# EAGLE design ReturnLossFixture (EAGLE 9.3.1)
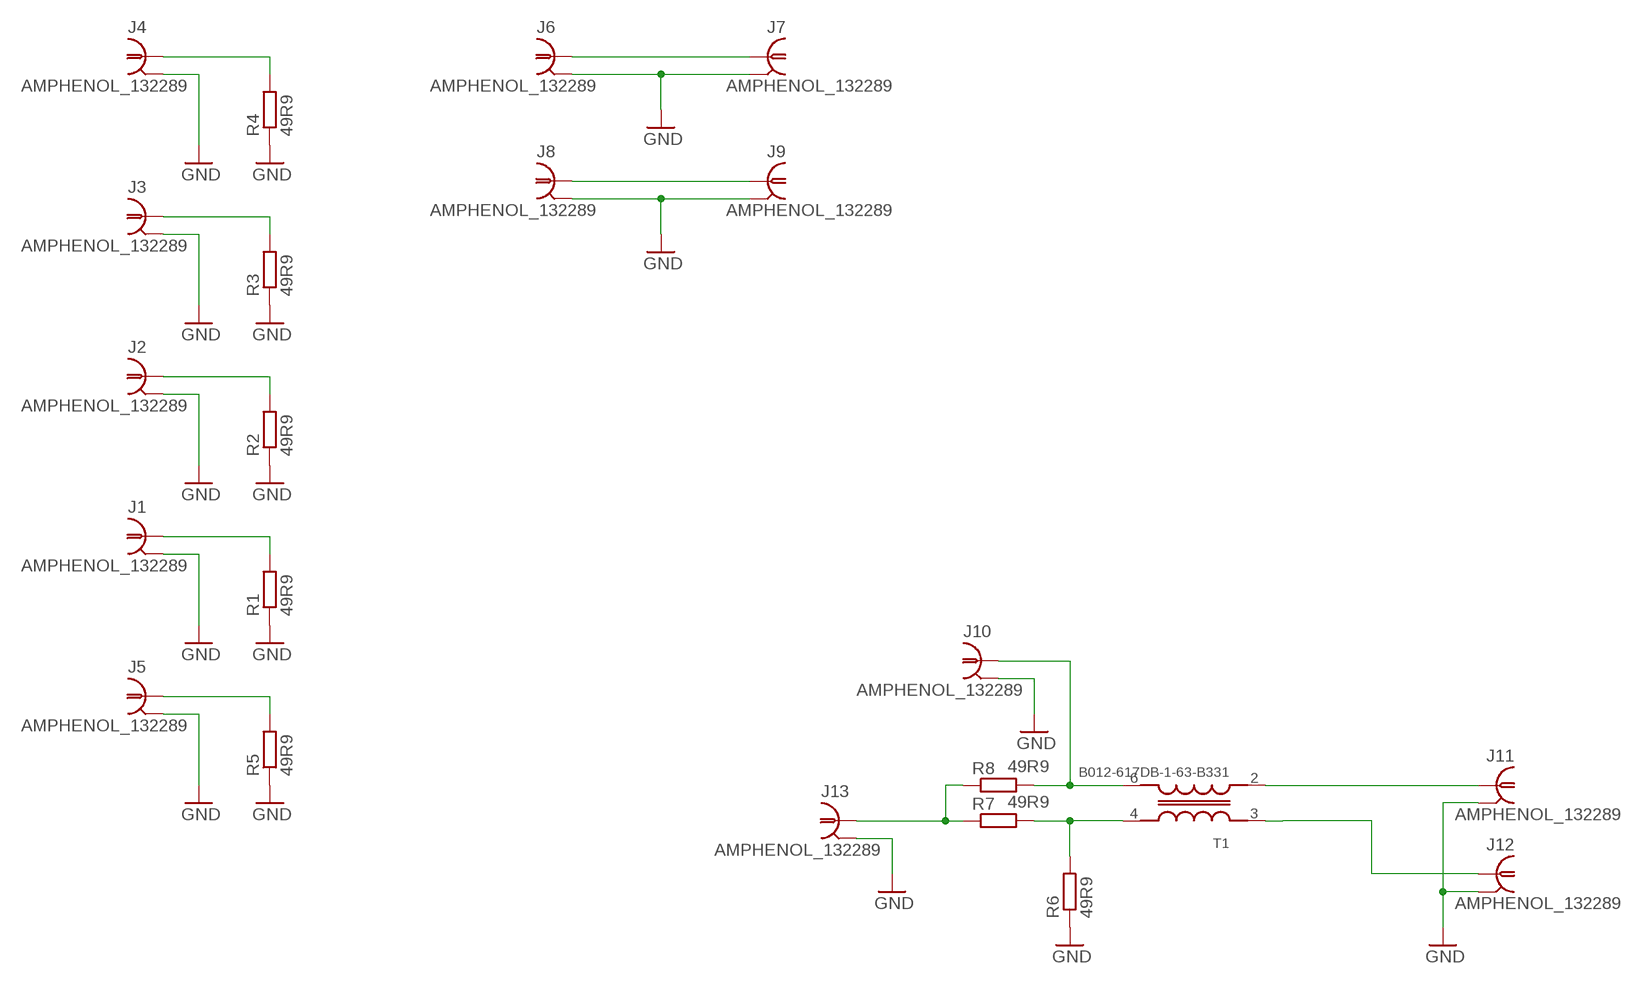
[diagram p0: schematic, sheet 1]

## Parts
J1  AMPHENOL_132289  [AMPHENOL_132289]
J2  AMPHENOL_132289  [AMPHENOL_132289]
J3  AMPHENOL_132289  [AMPHENOL_132289]
J4  AMPHENOL_132289  [AMPHENOL_132289]
J5  AMPHENOL_132289  [AMPHENOL_132289]
J6  AMPHENOL_132289  [AMPHENOL_132289]
J7  AMPHENOL_132289  [AMPHENOL_132289]
J8  AMPHENOL_132289  [AMPHENOL_132289]
J9  AMPHENOL_132289  [AMPHENOL_132289]
J10  AMPHENOL_132289  [AMPHENOL_132289]
J11  AMPHENOL_132289  [AMPHENOL_132289]
J12  AMPHENOL_132289  [AMPHENOL_132289]
J13  AMPHENOL_132289  [AMPHENOL_132289]
R1  49R9  R-EU_R0402  [R0402]
R2  49R9  R-EU_R0402  [R0402]
R3  49R9  R-EU_R0402  [R0402]
R4  49R9  R-EU_R0402  [R0402]
R5  49R9  R-EU_R0402  [R0402]
R6  49R9  R-EU_R0402  [R0402]
R7  49R9  R-EU_R0402  [R0402]
R8  49R9  R-EU_R0402  [R0402]
T1  B012-617DB-1-63-B331  [EASTEVER_BALUN]

## Nets
GND: J1.G@1 J1.G@2 J1.G@3 J1.G@4 J2.G@1 J2.G@2 J2.G@3 J2.G@4 J3.G@1 J3.G@2 J3.G@3 J3.G@4 J4.G@1 J4.G@2 J4.G@3 J4.G@4 J5.G@1 J5.G@2 J5.G@3 J5.G@4 J6.G@1 J6.G@2 J6.G@3 J6.G@4 J7.G@1 J7.G@2 J7.G@3 J7.G@4 J8.G@1 J8.G@2 J8.G@3 J8.G@4 J9.G@1 J9.G@2 J9.G@3 J9.G@4 J10.G@1 J10.G@2 J10.G@3 J10.G@4 J11.G@1 J11.G@2 J11.G@3 J11.G@4 J12.G@1 J12.G@2 J12.G@3 J12.G@4 J13.G@1 J13.G@2 J13.G@3 J13.G@4 R1.1 R2.1 R3.1 R4.1 R5.1 R6.1
N$1: J1.1 R1.2
N$2: J2.1 R2.2
N$3: J3.1 R3.2
N$4: J4.1 R4.2
N$5: J5.1 R5.2
N$6: J6.1 J7.1
N$7: J10.1 R8.2 T1.6(OUT-)
N$8: J8.1 J9.1
N$9: J12.1 T1.3(IN+)
N$10: J11.1 T1.2(IN-)
N$11: R6.2 R7.2 T1.4(OUT+)
N$12: J13.1 R7.1 R8.1

## Library data of the parts
J1-J13 = VNA:AMPHENOL_132289
R1-R8 = VNA:R-EU_: RESISTOR, European symbol
T1 = VNA:B012-617DB-1-63-B331

## Board
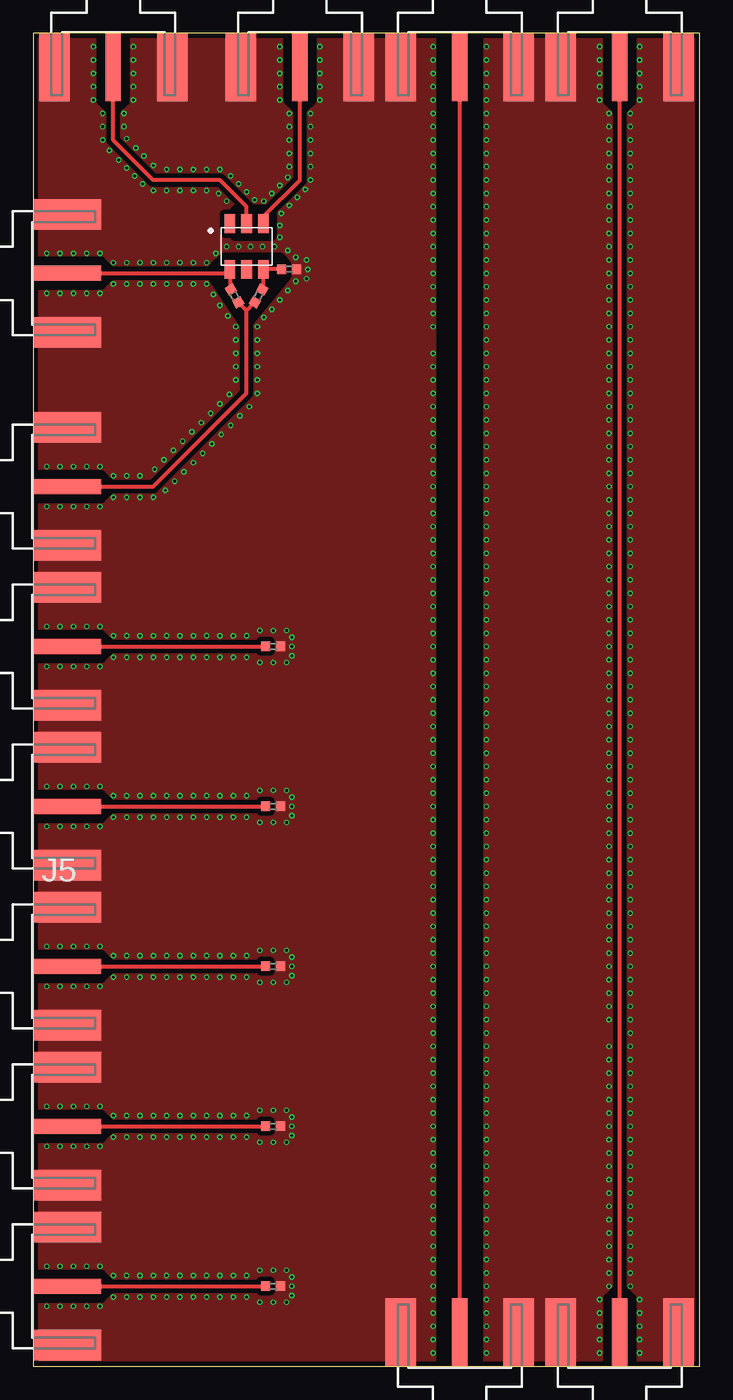
[diagram p1: board, top side]
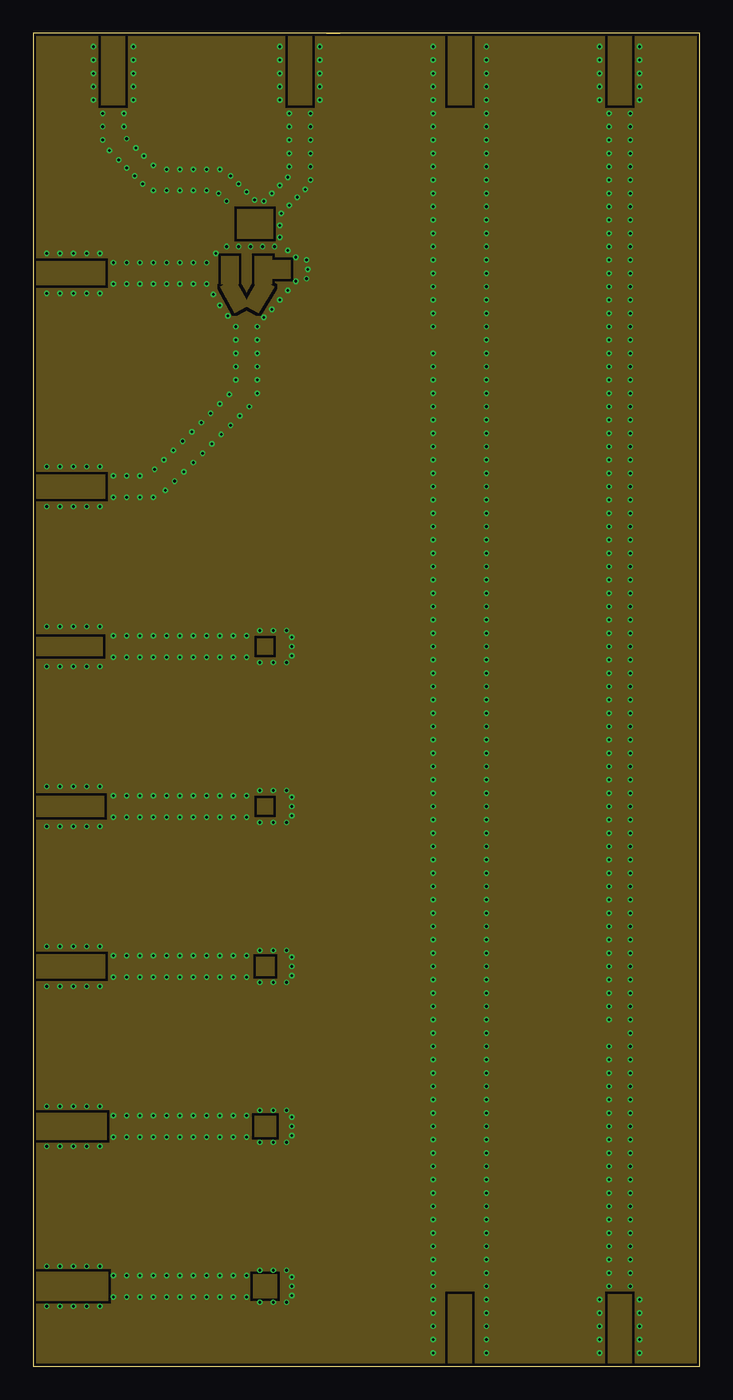
[diagram p2: board, inner layer Route2]
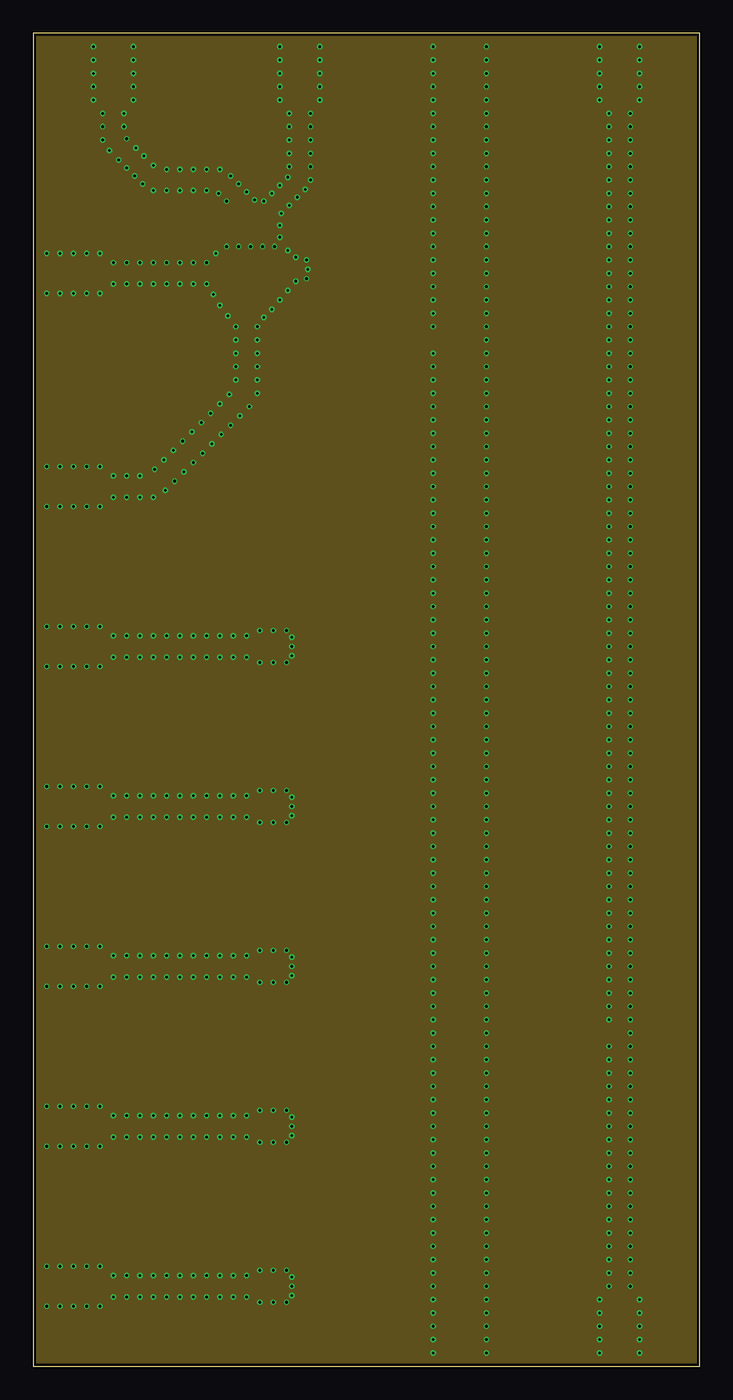
[diagram p3: board, inner layer Route15]
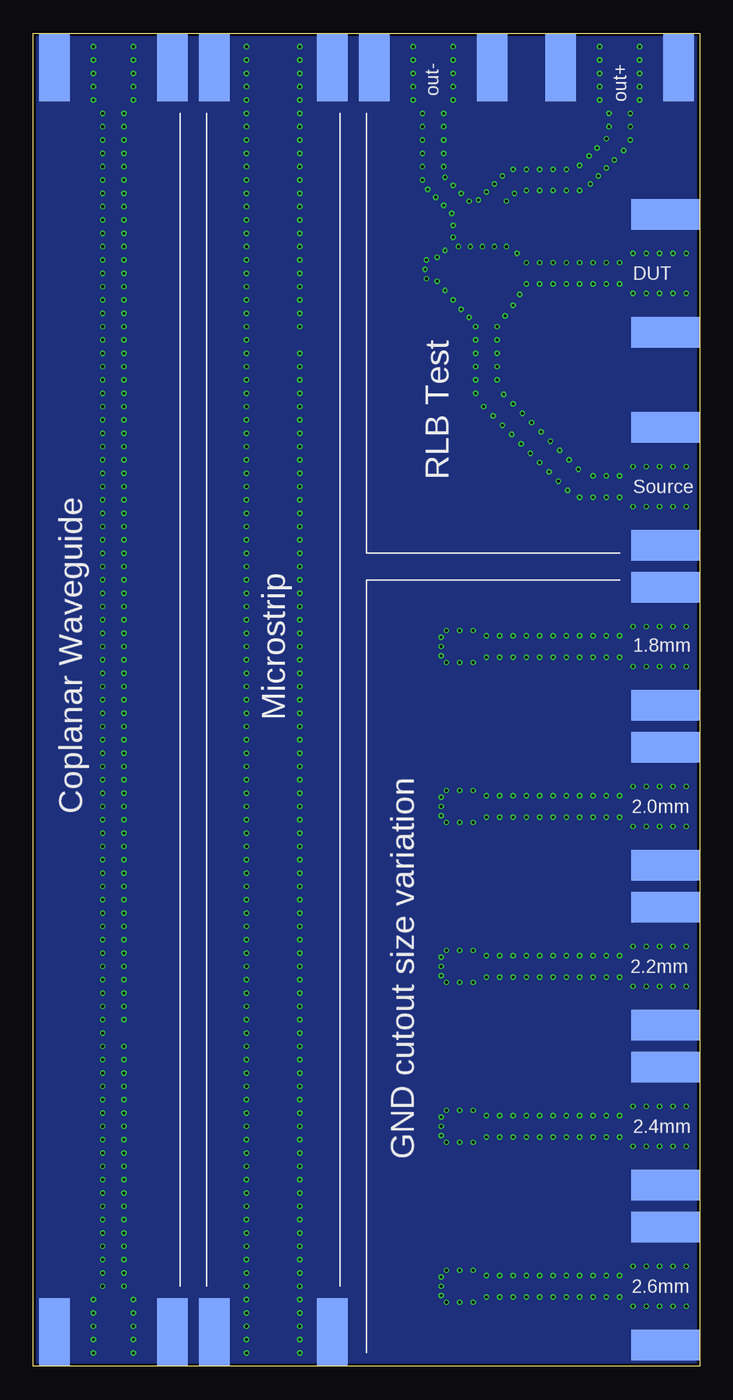
[diagram p4: board, bottom side, seen from below]

Size 50 x 100 mm. Coordinates in mm from the lower left corner, seen from the top.
Outline: 0,100 0,0 50,0 50,100 0,100
Copper layers (1+2*15+16): Top 0.035mm / dielectric 0.2mm / Route2 0.0175mm / dielectric 1.064mm / Route15 0.0175mm / dielectric 0.2mm / Bottom 0.035mm
Design rules "JLCPCB4L_7628 *": minimum track width 6mil, minimum drill 0.2mm, track to track 3.5mil, track to pad 3.5mil, pad to pad 3.5mil, via to via 3.5mil, smd to smd 0mil, copper to edge 0.2mm, drill to drill 0.2mm, minimum pad ring 10mil, minimum via ring 3.5mil, stop-mask expansion 4mil, vias tented up to drill 0mil, thermal gap 10mil
tRestrict: 57 lines

### Footprints (pad centres in the part's own frame; a part is rotated, then mirrored left to right if it is on the bottom)
AMPHENOL_132289 = smd 5.08 x 1.143: 1 2.565,0 | smd 5.08 x 2.286: G@1 2.565,4.42; G@2 2.565,-4.42 | smd 5.08 x 2.286 bottom: G@3 2.565,4.42; G@4 2.565,-4.42
R0402 = smd 0.67 x 0.72: 1 -0.56,0; 2 0.56,0
EASTEVER_BALUN = smd 1.4 x 0.8: 1 -1.715,-1.25; 2 -1.715,0; 3 -1.715,1.25; 4 1.715,1.25; 5 1.715,0; 6 1.715,-1.25

### Placement (x,y rotation side)
J1  0,6 0 top
J2  0,54 0 top
J3  0,18 0 top
J4  0,42 0 top
J5  0,30 0 top
J6  32,0 90 top
J7  32,100 270 top
J8  44,100 270 top
J9  44,0 90 top
J10  0,82 0 top
J11  6,100 270 top
J12  20,100 270 top
J13  0,66 0 top
R1  18,6 180 top
R2  18,54 180 top
R3  18,18 180 top
R4  18,42 180 top
R5  18,30 180 top
R6  19.2,82.3 180 top
R7  16.9,80.3 60 top
R8  15.1,80.3 120 top
T1  16,84 270 top

### Tracks (layer width: path | path; a pad name or v marks a point on that pad's centre or on a via)
CUTOUT
  Route2 0: 22,100 23,100
  pour Route2 (no thermals): 43.1,100 43.1,94.6 44.9,94.6 44.9,100
  pour Route2 (no thermals): 43.1,5.4 43.1,0 44.9,0 44.9,5.4
  pour Route2 (no thermals): 31.1,5.4 31.1,0 32.9,0 32.9,5.4
  pour Route2 (no thermals): 31.1,100 31.1,94.6 32.9,94.6 32.9,100
  pour Route2 (no thermals): 0,4.9 5.6,4.9 5.6,7.1 0,7.1
  pour Route2 (no thermals): 0,17 5.5,17 5.5,19 0,19
  pour Route2 (no thermals): 0,29.1 5.4,29.1 5.4,30.9 0,30.9
  pour Route2 (no thermals): 0,41.2 5.3,41.2 5.3,42.8 0,42.8
  pour Route2 (no thermals): 0,53.3 5.2,53.3 5.2,54.7 0,54.7
  pour Route2 (no thermals): 18.1,30.7 18.1,29.3 16.7,29.3 16.7,30.7
  pour Route2 (no thermals): 18,42.6 18,41.4 16.8,41.4 16.8,42.6
  pour Route2 (no thermals): 18,54.6 18,53.4 16.8,53.4 16.8,54.6
  pour Route2 (no thermals): 18.2,18.8 18.2,17.2 16.6,17.2 16.6,18.8
  pour Route2 (no thermals): 18.3,6.9 18.3,5.1 16.5,5.1 16.5,6.9
  pour Route2 (no thermals): 19.1,100 19.1,94.6 20.9,94.6 20.9,100
  pour Route2 (no thermals): 5.1,100 5.1,94.6 6.9,94.6 6.9,100
  pour Route2 (no thermals): 0,81.1 5.4,81.1 5.4,82.9 0,82.9
  pour Route2 (no thermals): 0,65.1 5.4,65.1 5.4,66.9 0,66.9
  pour Route2 (no thermals): 19.3,83 19.3,81.6 17.9,81.6 17.9,83
  pour Route2 (no thermals): 15.3,84.6 18,84.6 18,86.8 15.3,86.8
  pour Route2 (no thermals): 16.7,83.3 17.9,83.3 17.9,81.2 16.6,81.2 16.6,83.3
  pour Route2 (no thermals): 16.9,81.6 16,80 15.1,81.6 14,81 15.1,79 16,79.5 16.9,79 18.1,81
  pour Route2 (no thermals): 14.2,83.3 15.4,83.3 15.4,81.2 14.1,81.2 14.1,83.3
GND  (via drill 0.2 pad 0.4)
  other vias: 44.8,89 44.8,88 44.8,87 44.8,86 44.8,85 44.8,94 44.8,93 44.8,92 44.8,91 44.8,90 44.8,79 44.8,78 44.8,77 44.8,76 44.8,75 44.8,84 44.8,83 44.8,82 44.8,81 44.8,80 44.8,69 44.8,68 44.8,67 44.8,66 44.8,65 44.8,74 44.8,73 44.8,72 44.8,71 44.8,70 44.8,59 44.8,58 44.8,57 44.8,56 44.8,55 44.8,64 44.8,63 44.8,62 44.8,61 44.8,60 44.8,9 44.8,8 44.8,7 44.8,6 44.8,14 44.8,13 44.8,12 44.8,11 44.8,10 44.8,49 44.8,48 44.8,47 44.8,46 44.8,45 44.8,54 44.8,53 44.8,52 44.8,51 44.8,50 44.8,39 44.8,38 44.8,37 44.8,36 44.8,35 44.8,44 44.8,43 44.8,42 44.8,41 44.8,40 44.8,29 44.8,28 44.8,27 44.8,26 44.8,25 44.8,34 44.8,33 44.8,32 44.8,31 44.8,30 44.8,19 44.8,18 44.8,17 44.8,16 44.8,15 44.8,24 44.8,23 44.8,22 44.8,21 44.8,20 43.2,89 43.2,88 43.2,87 43.2,86 43.2,85 43.2,94 43.2,93 43.2,92 43.2,91 43.2,90 43.2,79 43.2,78 43.2,77 43.2,76 43.2,75 43.2,84 43.2,83 43.2,82 43.2,81 43.2,80 43.2,69 43.2,68 43.2,67 43.2,66 43.2,65 43.2,74 43.2,73 43.2,72 43.2,71 43.2,70 43.2,59 43.2,58 43.2,57 43.2,56 43.2,55 43.2,64 43.2,63 43.2,62 43.2,61 43.2,60 43.2,9 43.2,8 43.2,7 43.2,6 43.2,14 43.2,13 43.2,12 43.2,11 43.2,10 43.2,49 43.2,48 43.2,47 43.2,46 43.2,45 43.2,54 43.2,53 43.2,52 43.2,51 43.2,50 43.2,39 43.2,38 43.2,37 43.2,36 43.2,35 43.2,44 43.2,43 43.2,42 43.2,41 43.2,40 43.2,29 43.2,28 43.2,27 43.2,26 43.2,34 43.2,33 43.2,32 43.2,31 43.2,30 43.2,19 43.2,18 43.2,17 43.2,16 43.2,15 43.2,24 43.2,23 43.2,22 43.2,21 43.2,20 42.5,95 42.5,96 42.5,97 42.5,98 42.5,99 45.5,99 45.5,98 45.5,97 45.5,96 45.5,95 42.5,5 42.5,4 42.5,3 42.5,2 42.5,1 45.5,1 45.5,2 45.5,3 45.5,4 45.5,5 30,89 30,88 30,87 30,86 30,85 30,94 30,93 30,92 30,91 30,90 30,79 30,78 30,76 30,75 30,84 30,83 30,82 30,81 30,80 30,69 30,68 30,67 30,66 30,65 30,74 30,73 30,72 30,71 30,70 30,59 30,58 30,57 30,56 30,55 30,64 30,63 30,62 30,61 30,60 30,9 30,8 30,7 30,6 30,14 30,13 30,12 30,11 30,10 30,49 30,48 30,47 30,46 30,45 30,54 30,53 30,52 30,51 30,50 30,39 30,38 30,37 30,36 30,35 30,44 30,43 30,42 30,41 30,40 30,29 30,28 30,27 30,26 30,25 30,34 30,33 30,32 30,31 30,30 30,19 30,18 30,17 30,16 30,15 30,24 30,23 30,22 30,21 30,20 30,95 30,96 30,97 30,98 30,99 34,99 34,98 34,97 34,96 34,95 34,89 34,88 34,87 34,86 34,85 34,94 34,93 34,92 34,91 34,90 34,79 34,78 34,77 34,76 34,75 34,84 34,83 34,82 34,81 34,80 34,69 34,68 34,67 34,66 34,65 34,74 34,73 34,72 34,71 34,70 34,59 34,58 34,57 34,56 34,55 34,64 34,63 34,62 34,61 34,60 34,9 34,8 34,7 34,6 34,14 34,13 34,12 34,11 34,10 34,49 34,48 34,47 34,46 34,45 34,54 34,53 34,52 34,51 34,50 34,39 34,38 34,37 34,36 34,35 34,44 34,43 34,42 34,41 34,40 34,29 34,28 34,27 34,26 34,25 34,34 34,33 34,32 34,31 34,30 34,19 34,18 34,17 34,16 34,15 34,24 34,23 34,22 34,21 34,20 30,5 30,4 30,3 30,2 30,1 34,1 34,2 34,3 34,4 34,5 6,54.8 7,54.8 8,54.8 9,54.8 10,54.8 11,54.8 12,54.8 13,54.8 14,54.8 15,54.8 16,54.8 17,55.2 18,55.2 19,55.2 19,52.8 18,52.8 17,52.8 19.4,53.3 19.4,54 19.4,54.7 6,53.2 7,53.2 8,53.2 9,53.2 10,53.2 11,53.2 12,53.2 13,53.2 14,53.2 15,53.2 16,53.2 5,55.5 4,55.5 3,55.5 2,55.5 1,55.5 1,52.5 2,52.5 3,52.5 4,52.5 5,52.5 6,42.8 7,42.8 8,42.8 9,42.8 10,42.8 11,42.8 12,42.8 13,42.8 14,42.8 15,42.8 16,42.8 17,43.2 18,43.2 19,43.2 19,40.8 18,40.8 17,40.8 19.4,41.3 19.4,42 19.4,42.7 6,41.2 7,41.2 8,41.2 9,41.2 10,41.2 11,41.2 12,41.2 13,41.2 14,41.2 15,41.2 16,41.2 5,43.5 4,43.5 3,43.5 2,43.5 1,43.5 1,40.5 2,40.5 3,40.5 4,40.5 5,40.5 6,30.8 7,30.8 8,30.8 9,30.8 10,30.8 11,30.8 12,30.8 13,30.8 14,30.8 15,30.8 16,30.8 17,31.2 18,31.2 19,31.2 19,28.8 18,28.8 17,28.8 19.4,29.3 19.4,30 19.4,30.7 6,29.2 7,29.2 8,29.2 9,29.2 10,29.2 11,29.2 12,29.2 13,29.2 14,29.2 15,29.2 16,29.2 5,31.5 4,31.5 3,31.5 2,31.5 1,31.5 1,28.5 2,28.5 3,28.5 4,28.5 5,28.5 6,18.8 7,18.8 8,18.8 9,18.8 10,18.8 11,18.8 12,18.8 13,18.8 14,18.8 15,18.8 16,18.8 17,19.2 18,19.2 19,19.2 19,16.8 18,16.8 17,16.8 19.4,17.3 19.4,18 19.4,18.7 6,17.2 7,17.2 8,17.2 9,17.2 10,17.2 11,17.2 12,17.2 13,17.2 14,17.2 15,17.2 16,17.2 5,19.5 4,19.5 3,19.5 2,19.5 1,19.5 1,16.5 2,16.5 3,16.5 4,16.5 5,16.5 6,6.8 7,6.8 8,6.8 9,6.8 10,6.8 11,6.8 12,6.8 13,6.8 14,6.8 15,6.8 16,6.8 17,7.2 18,7.2 19,7.2 19,4.8 18,4.8 17,4.8 19.4,5.3 19.4,6 19.4,6.7 6,5.2 7,5.2 8,5.2 9,5.2 10,5.2 11,5.2 12,5.2 13,5.2 14,5.2 15,5.2 16,5.2 5,7.5 4,7.5 3,7.5 2,7.5 1,7.5 1,4.5 2,4.5 3,4.5 4,4.5 5,4.5 6,66.8 7,66.8 8,66.8 6,65.2 7,65.2 8,65.2 9,65.2 9.9,65.7 10.6,66.4 11.3,67.1 12,67.8 12.7,68.5 13.4,69.2 14.1,69.9 14.8,70.6 15.5,71.3 16.2,72 16.8,73 16.8,74 16.8,75 16.8,76 16.8,77 16.8,78 15.2,78 15.2,77 15.2,76 15.2,75 15.2,74 14.7,72.9 14,72.2 13.3,71.5 12.6,70.8 11.9,70.1 11.2,69.4 10.5,68.7 9.8,68 9.1,67.3 5,67.5 4,67.5 3,67.5 2,67.5 1,67.5 1,64.5 2,64.5 3,64.5 4,64.5 5,64.5 6,82.8 7,82.8 8,82.8 9,82.8 10,82.8 11,82.8 12,82.8 13,82.8 13,81.2 12,81.2 11,81.2 10,81.2 9,81.2 8,81.2 7,81.2 6,81.2 5,80.5 4,80.5 3,80.5 2,80.5 1,80.5 1,83.5 2,83.5 3,83.5 4,83.5 5,83.5 13.7,83.5 14.5,84 15.4,84 16.3,84 17.2,84 19.1,83.7 19.7,83.2 20.5,83 20.6,82.3 20.5,81.6 19.7,81.4 19.1,80.7 18.5,80 17.9,79.3 17.3,78.7 14.6,78.8 14,79.6 13.5,80.4 18.5,99 18.5,98 18.5,97 18.5,96 18.5,95 21.5,95 21.5,96 21.5,97 21.5,98 21.5,99 20.8,94 20.8,93 20.8,92 20.8,91 20.8,90 20.8,89 19.2,94 19.2,93 19.2,92 19.2,91 19.2,90 4.5,99 4.5,98 4.5,97 4.5,96 4.5,95 7.5,95 7.5,96 7.5,97 7.5,98 7.5,99 5.2,94 5.2,93 5.2,92 6.8,94 6.8,93 9,88.2 10,88.2 11,88.2 12,88.2 13,88.2 13,89.8 14,89.8 12,89.8 11,89.8 10,89.8 8.2,88.7 7.6,89.3 7,89.9 6.4,90.5 5.7,91.2 7,92.1 7.7,91.4 8.3,90.8 9,90.1 14.8,89.3 15.4,88.7 16,88.1 16.6,87.5 17.3,87.4 17.9,88 18.5,88.6 19.1,89.2 20.4,88.3 19.8,87.7 19.2,87.1 18.6,86.5 18.5,85.6 18.5,84.7 13.9,88 14.5,87.4 18.1,84
  pour Top (isolate 0.36, no thermals): 38,100 50,100 50,0 38,0
  pour Route2 (isolate 0.2, rank 6, no thermals): 0,100 50,100 50,0 0,0
  pour Top (isolate 0.36, no thermals): 0,100 38,100 38,0 0,0
  pour Route15 (no thermals): 0,100 0,0 50,0 50,100
  pour Bottom (no thermals): 0,100 50,100 50,0 0,0 0,99.9
N$1
  Top 0.3: J1.1 R1.2
N$2
  Top 0.3: J2.1 R2.2
N$3
  Top 0.3: J3.1 R3.2
N$4
  Top 0.3: J4.1 R4.2
N$5
  Top 0.3: J5.1 R5.2
N$6
  Top 0.3: J6.1 J7.1
N$7
  Top 0.3: J10.1 14.46,82 T1.6 14.75,80.86 R8.2
N$8
  Top 0.3: J9.1 J8.1
N$9
  Top 0.3: T1.3 17.25,86.25 20,89 J12.1
N$10
  Top 0.3: T1.2 16,87 14,89 9,89 6,92 J11.1
N$11
  Top 0.3: R7.2 17.25,80.86 T1.4 17.27,82.3 R6.2
N$12
  Top 0.3: J13.1 9,66 16,73 16,79.19 | 16,79.19 R7.1 | 16,79.19 R8.1

### Text on the board
bPlace: out+ | out- | DUT | RLB Test | Source | Coplanar Waveguide | 1.8mm | Microstrip | GND cutout size variation | 2.0mm | 2.2mm | 2.4mm | 2.6mm